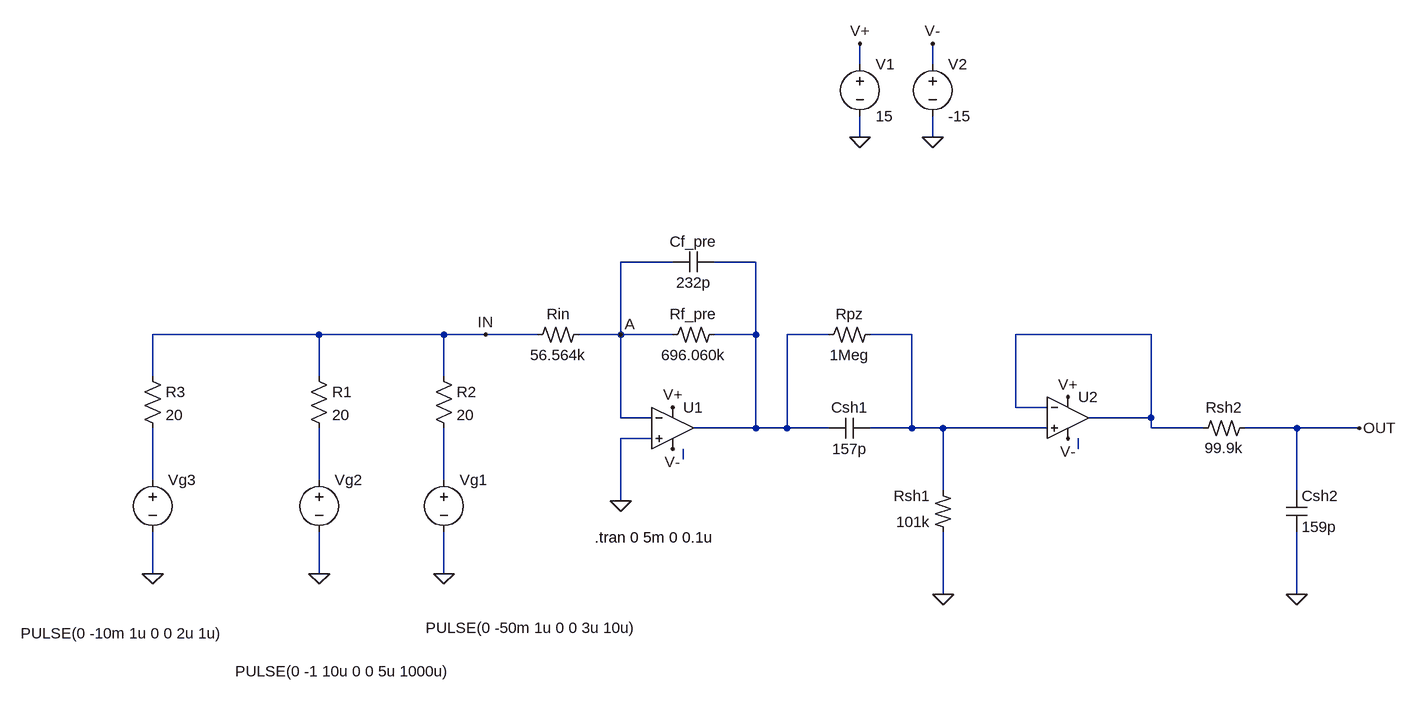
[diagram p0: schematic Shaper_PreAmp_Rpz.asc]
Shaper_PreAmp_Rpz.asc, the LTspice schematic file:
Version 4
SHEET 1 1540 680
WIRE 672 -368 672 -400
WIRE 784 -368 784 -400
WIRE 672 -256 672 -288
WIRE 784 -256 784 -288
WIRE 384 -64 304 -64
WIRE 512 -64 448 -64
WIRE -160 48 -416 48
WIRE 32 48 -160 48
WIRE 96 48 32 48
WIRE 176 48 96 48
WIRE 304 48 304 -64
WIRE 304 48 240 48
WIRE 384 48 304 48
WIRE 512 48 512 -64
WIRE 512 48 448 48
WIRE 624 48 560 48
WIRE 752 48 688 48
WIRE 1120 48 912 48
WIRE -416 112 -416 48
WIRE -160 112 -160 48
WIRE 32 112 32 48
WIRE 912 160 912 48
WIRE 960 160 912 160
WIRE 304 176 304 48
WIRE 352 176 304 176
WIRE 1120 176 1120 48
WIRE 1120 176 1024 176
WIRE 512 192 512 48
WIRE 512 192 416 192
WIRE 560 192 560 48
WIRE 560 192 512 192
WIRE 624 192 560 192
WIRE 752 192 752 48
WIRE 752 192 688 192
WIRE 800 192 752 192
WIRE 960 192 800 192
WIRE 1120 192 1120 176
WIRE 1200 192 1120 192
WIRE 1344 192 1264 192
WIRE 1440 192 1344 192
WIRE 352 208 304 208
WIRE 1008 224 1008 208
WIRE 400 240 400 224
WIRE -416 272 -416 192
WIRE -160 272 -160 192
WIRE 32 272 32 192
WIRE 800 288 800 192
WIRE 1344 288 1344 192
WIRE 304 304 304 208
WIRE -416 416 -416 352
WIRE -160 416 -160 352
WIRE 32 416 32 352
WIRE 800 448 800 352
WIRE 1344 448 1344 352
FLAG 672 -256 0
FLAG 784 -256 0
FLAG 672 -400 V+
FLAG 784 -400 V-
FLAG 304 304 0
FLAG 96 48 IN
FLAG 384 224 V-
FLAG 384 160 V+
FLAG 304 48 A
FLAG 992 208 V-
FLAG 992 144 V+
FLAG 800 448 0
FLAG 1344 448 0
FLAG 1440 192 OUT
FLAG 32 416 0
FLAG -160 416 0
FLAG -416 416 0
SYMBOL voltage 672 -384 R0
WINDOW 123 24 126 Left 2
WINDOW 39 24 111 Left 2
SYMATTR InstName V1
SYMATTR Value 15
SYMBOL voltage 784 -384 R0
WINDOW 123 24 126 Left 2
WINDOW 39 24 111 Left 2
SYMATTR InstName V2
SYMATTR Value -15
SYMBOL Opamps/UniversalOpamp2 384 192 R0
SYMATTR InstName U1
SYMBOL res2 240 32 R90
WINDOW 0 0 32 VBottom 2
WINDOW 3 32 32 VTop 2
SYMATTR InstName Rin
SYMATTR Value 56.564k
SYMBOL res2 448 32 R90
WINDOW 0 0 32 VBottom 2
WINDOW 3 32 32 VTop 2
SYMATTR InstName Rf_pre
SYMATTR Value 696.060k
SYMBOL cap 448 -80 R90
WINDOW 0 0 32 VBottom 2
WINDOW 3 32 32 VTop 2
SYMATTR InstName Cf_pre
SYMATTR Value 232p
SYMBOL Opamps/UniversalOpamp2 992 176 R0
SYMATTR InstName U2
SYMBOL cap 688 176 R90
WINDOW 0 0 32 VBottom 2
WINDOW 3 32 32 VTop 2
SYMATTR InstName Csh1
SYMATTR Value 157p
SYMBOL res2 816 352 R180
WINDOW 0 36 56 Left 2
WINDOW 3 36 16 Left 2
SYMATTR InstName Rsh1
SYMATTR Value 101k
SYMBOL res2 1264 176 R90
WINDOW 0 0 32 VBottom 2
WINDOW 3 31 32 VTop 2
SYMATTR InstName Rsh2
SYMATTR Value 99.9k
SYMBOL cap 1328 288 R0
SYMATTR InstName Csh2
SYMATTR Value 159p
SYMBOL res2 688 32 R90
WINDOW 0 0 32 VBottom 2
WINDOW 3 32 32 VTop 2
SYMATTR InstName Rpz
SYMATTR Value 1Meg
SYMBOL voltage 32 256 R0
WINDOW 3 -28 243 Left 2
WINDOW 123 0 0 Left 0
WINDOW 39 0 0 Left 0
SYMATTR Value PULSE(0 -50m 1u 0 0 3u 10u)
SYMATTR InstName Vg1
SYMBOL voltage -160 256 R0
WINDOW 3 -129 310 Left 2
WINDOW 123 0 0 Left 0
WINDOW 39 0 0 Left 0
SYMATTR Value PULSE(0 -1 10u 0 0 5u 1000u)
SYMATTR InstName Vg2
SYMBOL res -176 96 R0
SYMATTR InstName R1
SYMATTR Value 20
SYMBOL res 16 96 R0
SYMATTR InstName R2
SYMATTR Value 20
SYMBOL voltage -416 256 R0
WINDOW 3 -203 252 Left 2
WINDOW 123 0 0 Left 0
WINDOW 39 0 0 Left 0
SYMATTR Value PULSE(0 -10m 1u 0 0 2u 1u)
SYMATTR InstName Vg3
SYMBOL res -432 96 R0
SYMATTR InstName R3
SYMATTR Value 20
TEXT 264 360 Left 2 !.tran 0 5m 0 0.1u

The netlist it stands for:
* Shaper_PreAmp_Rpz.asc
V1 V+ 0 15
V2 V- 0 -15
XU1 0 A V+ V- N001 level.2 Avol=1Meg GBW=10Meg Slew=10Meg ilimit=25m rail=0 Vos=0 phimargin=45 en=0 enk=0 in=0 ink=0 Rin=500Meg  ; pins IN+ IN- V+ V- OUT
Rin A IN 56.564k
Rf_pre N001 A 696.060k
Cf_pre N001 A 232p
XU2 N002 N003 V+ V- N003 level.2 Avol=1Meg GBW=10Meg Slew=10Meg ilimit=25m rail=0 Vos=0 phimargin=45 en=0 enk=0 in=0 ink=0 Rin=500Meg  ; pins IN+ IN- V+ V- OUT
Csh1 N002 N001 157p
Rsh1 0 N002 101k
Rsh2 OUT N003 99.9k
Csh2 OUT 0 159p
Rpz N002 N001 1Meg
Vg1 N008 0 PULSE(0 -50m 1u 0 0 3u 10u)
Vg2 N007 0 PULSE(0 -1 10u 0 0 5u 1000u)
R1 IN N007 20
R2 IN N008 20
Vg3 N006 0 PULSE(0 -10m 1u 0 0 2u 1u)
R3 IN N006 20
.tran 0 5m 0 0.1u
.lib UniversalOpamps2.sub
.backanno
.end

* Results of the author's LTspice run, read from the files saved beside the schematic
* Operating Point, zero values left out:
*   V(v+) = 15 V
*   V(v-) = -15 V
*   I(V2) = 2.997 mA
*   I(V1) = -2.997 mA
*   Ix(u1:3) = 1.498 mA
*   Ix(u1:4) = -1.498 mA
*   Ix(u2:3) = 1.498 mA
*   Ix(u2:4) = -1.498 mA
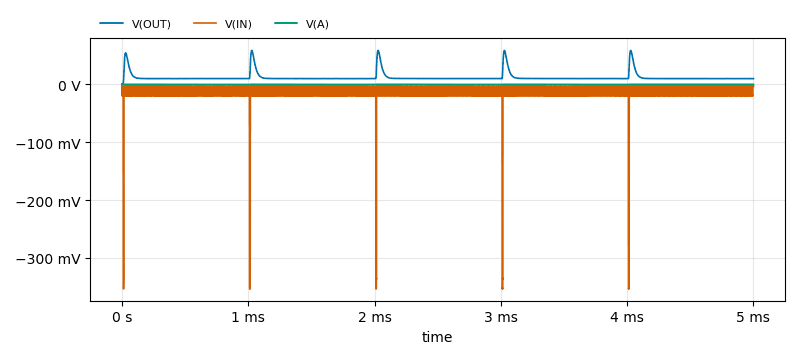
[diagram p1: Transient Analysis of Shaper_PreAmp_Rpz.asc, plotted from the saved traces]
* Transient Analysis, 1 run:
*   V(OUT): min 0 V, max 58.68 mV, average 11.89 mV, rms 14.21 mV, last 9.887 mV
*   V(IN): min -353.3 mV, max 0 V, average -10.6 mV, rms 27.93 mV, last -3.333 mV
*   V(A): min -424.5 µV, max 21.79 µV, average -439.3 nV, rms 31.22 µV, last 6.397 µV